# EAGLE design stm32cnc (EAGLE 9.6.2)
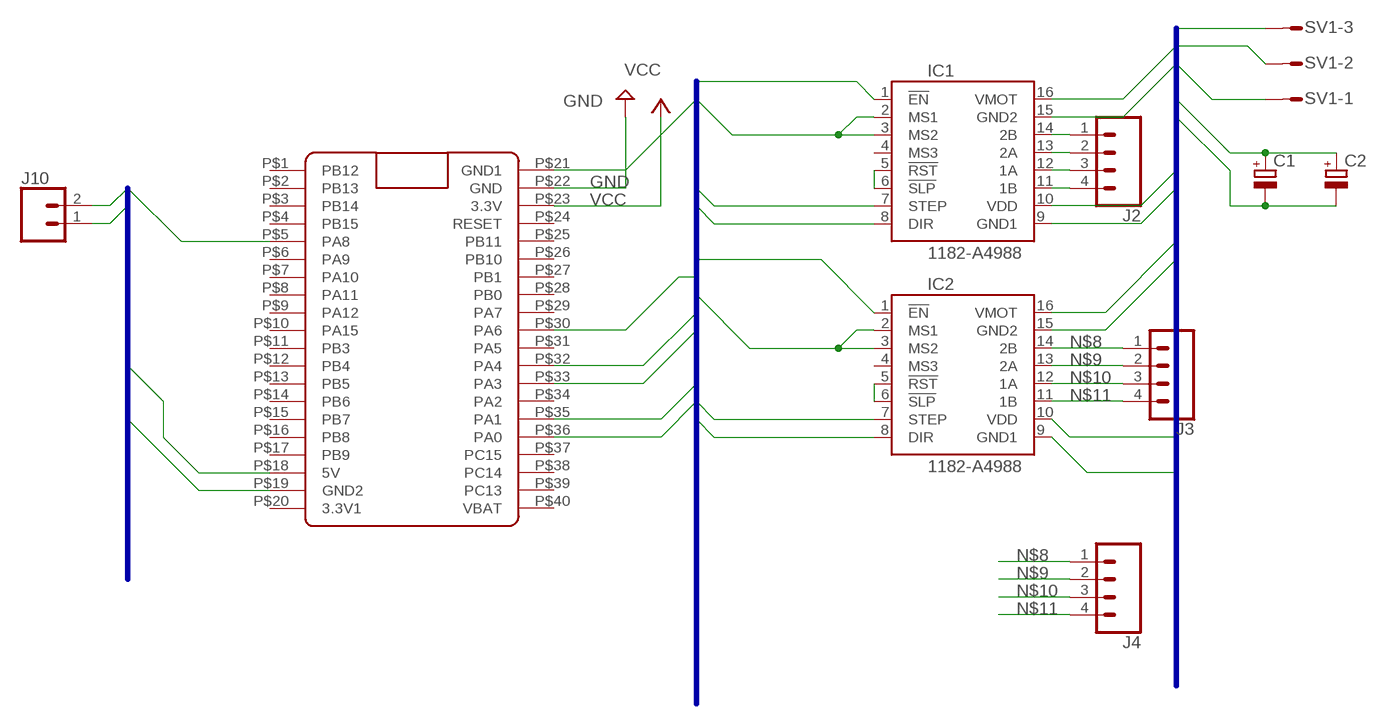
[diagram p0: schematic, sheet 1]

## Parts
C1  CPOL-EUE2,5-6E  [E2,5-6E]
C2  CPOL-EUE2,5-6E  [E2,5-6E]
IC1  1182-A4988  [A4988]
IC2  1182-A4988  [A4988]
J2  CONN_04POLAR  [MOLEX-1X4]
J3  CONN_04POLAR  [MOLEX-1X4]
J4  CONN_04POLAR  [MOLEX-1X4]
J10  CONN_02POLAR  [MOLEX-1X2]
SV1  MT6-3  [MT6-3]
U$1  BLUE_PILL  [BLUE_PILL]

## Nets
5-VCC: IC1.10(VDD) IC2.10(VDD) SV1.2 U$1.P$18(5V)
12-VCC: C1.+ C2.+ IC1.16(VMOT) IC2.16(VMOT) SV1.3
EN: IC1.1(!EN) IC2.1(!EN) U$1.P$30(PA6)
GND: C1.- C2.- IC1.9(GND1) IC1.15(GND2) IC2.9(GND1) IC2.15(GND2) J10.1 SV1.1 U$1.P$19(GND2) U$1.P$21(GND1) U$1.P$22(GND)
N$1: IC1.5(!RST) IC1.6(!SLP)
N$2: IC2.5(!RST) IC2.6(!SLP)
N$4: IC1.14(2B) J2.1
N$5: IC1.13(2A) J2.2
N$6: IC1.12(1A) J2.3
N$7: IC1.11(1B) J2.4
N$8: IC2.14(2B) J3.1 J4.1
N$9: IC2.13(2A) J3.2 J4.2
N$10: IC2.12(1A) J3.3 J4.3
N$11: IC2.11(1B) J3.4 J4.4
PWM: J10.2 U$1.P$5(PA8)
VCC: IC1.2(MS1) IC1.3(MS2) IC2.2(MS1) IC2.3(MS2) U$1.P$23(3.3V)
X-DIR: IC1.8(DIR) U$1.P$33(PA3)
X-STEP: IC1.7(STEP) U$1.P$36(PA0)
Y-DIR: IC2.8(DIR) U$1.P$32(PA4)
Y-STEP: IC2.7(STEP) U$1.P$35(PA1)
Unconnected: IC1.4(MS3) IC2.4(MS3) U$1.P$1(PB12) U$1.P$2(PB13) U$1.P$3(PB14) U$1.P$4(PB15) U$1.P$6(PA9) U$1.P$7(PA10) U$1.P$8(PA11) U$1.P$9(PA12) U$1.P$10(PA15) U$1.P$11(PB3) U$1.P$12(PB4) U$1.P$13(PB5) U$1.P$14(PB6) U$1.P$15(PB7) U$1.P$16(PB8) U$1.P$17(PB9) U$1.P$20(3.3V1) U$1.P$24(RESET) U$1.P$25(PB11) U$1.P$26(PB10) U$1.P$27(PB1) U$1.P$28(PB0) U$1.P$29(PA7) U$1.P$31(PA5) U$1.P$34(PA2) U$1.P$37(PC15) U$1.P$38(PC14) U$1.P$39(PC13) U$1.P$40(VBAT)

## Buses
5-VCC,12-VCC,E-GND,E-VCC,GND,VCC
EN,GND,RESET,VCC,X-DIR,X-LIMIT,X-STEP,Y-DIR,Y-LIMIT,Y-STEP
5-VCC,CTRL-RESET,DOOR,FLOOD,GND,HOLD,MIST,PROB,PWM,START,VCC

## Library data of the parts
C1 C2 = rcl:CPOL-EU: POLARIZED CAPACITOR, European symbol; SPICEPREFIX: C
IC1 IC2 = pololu-stepper-driver:1182-A4988: A4988 Stepper Motor Driver Carrier #1182 A4988 Stepper Motor Driver Carrier <https://www.pololu.com/product/1182> in Japan, Suzaku Lab. Ltd. <https://suzakugiken.jp/> #1182 A4988ステッピングモータドライバ <https://szc.jp/po1182>
J2-J4 = SparkFun-Connectors:CONN_04: Multi connection point. Often used as Generic Header-pin footprint for 0.1 inch spaced/style header connections On any of the 0.1 inch spaced packages, you can populate with these: Break Away Headers - Straight <https://www.sparkfun.com/products/116> (PRT-00116) Break Away Male Headers - Right Angle <https://www.sparkfun.com/products/553> (PRT-00553) Female Headers <https://www.sparkfun.com/products/115> (PRT-00115) Break Away Headers - Machine Pin <https://www.sparkfun.com/products/117> (PRT-00117) Break Away Female Headers - Swiss Machine Pin <https://www.sparkfun.com/products/743> (PRT-00743) For SCREWTERMINALS and SPRING TERMINALS visit here: Screw Terimnals on SparkFun.com <https://www.sparkfun.com/search/results?term=Screw+Terminals> (5mm/3.5mm/2.54mm spacing) This device is also useful as a general connection point to wire up your design to another part of your project. Our various solder wires solder well into these plated through hole pads. Hook-Up Wire - Assortment (Stranded, 22 AWG) <https://www.sparkfun.com/products/11375> (PRT-11375) Hook-Up Wire - Assortment (Solid Core, 22 AWG) <https://www.sparkfun.com/products/11367> (PRT-11367) View the entire wire category on our website here <https://www.sparkfun.com/categories/141> Special notes: Molex polarized connector foot print use with SKU : PRT-08231 with associated crimp pins and housings. 1MM SMD Version SKU: PRT-10208; PROD_ID: CONN-08186; SF_ID: PRT-08231
J10 = SparkFun-Connectors:CONN_02: Multi connection point. Often used as Generic Header-pin footprint for 0.1 inch spaced/style header connections On any of the 0.1 inch spaced packages, you can populate with these: Break Away Headers - Straight <https://www.sparkfun.com/products/116> (PRT-00116) Break Away Male Headers - Right Angle <https://www.sparkfun.com/products/553> (PRT-00553) Female Headers <https://www.sparkfun.com/products/115> (PRT-00115) Break Away Headers - Machine Pin <https://www.sparkfun.com/products/117> (PRT-00117) Break Away Female Headers - Swiss Machine Pin <https://www.sparkfun.com/products/743> (PRT-00743) For SCREWTERMINALS and SPRING TERMINALS visit here: Screw Terimnals on SparkFun.com <https://www.sparkfun.com/search/results?term=Screw+Terminals> (5mm/3.5mm/2.54mm spacing) This device is also useful as a general connection point to wire up your design to another part of your project. Our various solder wires solder well into these plated through hole pads. Hook-Up Wire - Assortment (Stranded, 22 AWG) <https://www.sparkfun.com/products/11375> (PRT-11375) Hook-Up Wire - Assortment (Solid Core, 22 AWG) <https://www.sparkfun.com/products/11367> (PRT-11367) View the entire wire category on our website here <https://www.sparkfun.com/categories/141> Special notes: Molex polarized connector foot print use with: PRT-08233 with associated crimp pins and housings. 2.54_SCREWTERM for use with PRT-10571. 3.5mm Screw Terminal footprints for PRT-08084 5mm Screw Terminal footprints for use with PRT-08432; SF_ID: PRT-09918
SV1 = con-amp-mt6:MT6-3: AMP MT6 CONNECTOR; OC_FARNELL: unknown; OC_NEWARK: unknown
U$1 = BluePill:BLUE_PILL

## Board
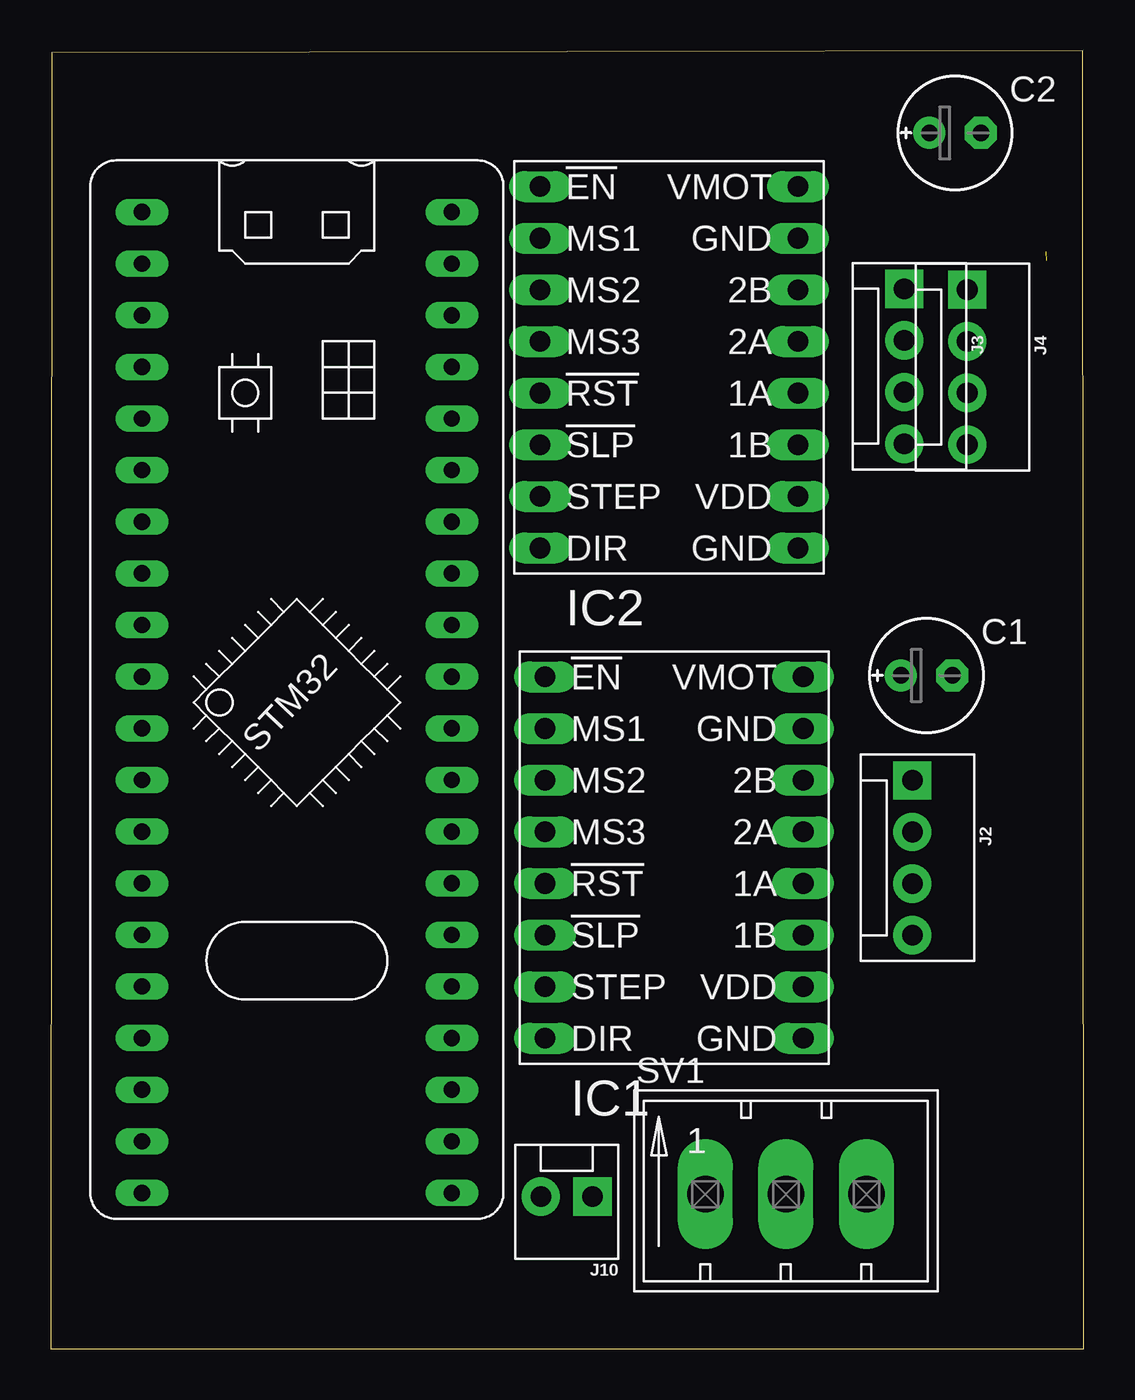
[diagram p1: board, top side]
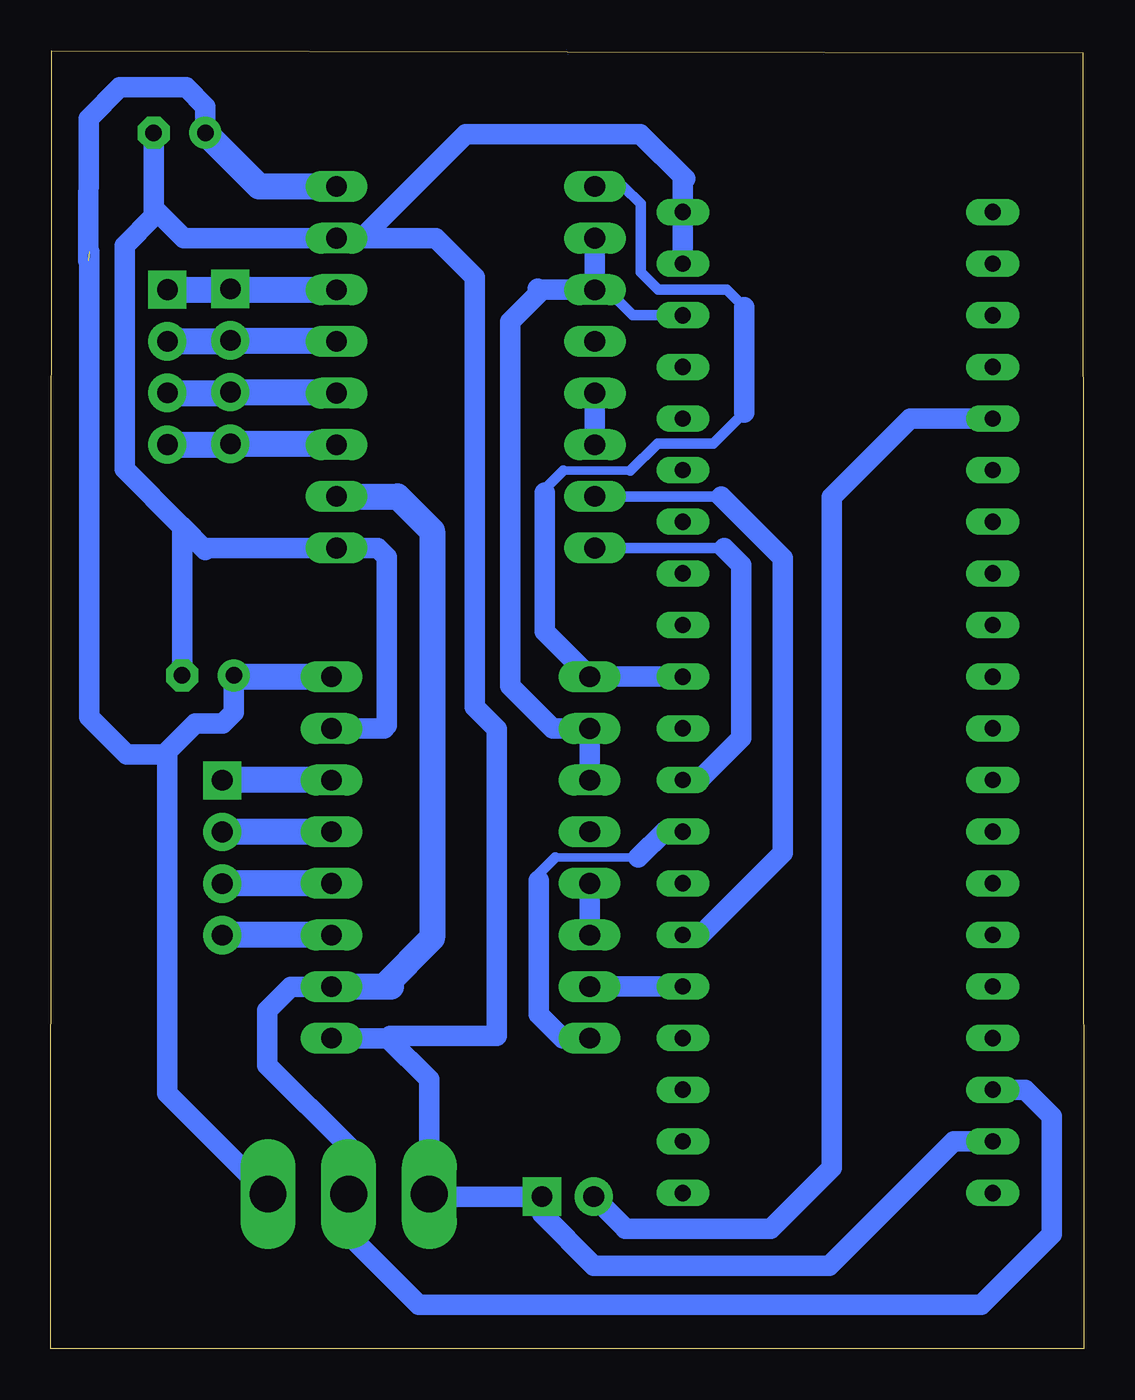
[diagram p2: board, bottom side, seen from below]

Size 50.8 x 63.85 mm. Coordinates in mm from the lower left corner, seen from the top.
Outline: 0,0 50.8,0 50.75,63.85 0.05,63.75 0,0
Copper layers (1*16): Top 0.035mm / dielectric 1.5mm / Bottom 0.035mm
Design rules "default *": minimum track width 6mil, minimum drill 0.35mm, track to track 20mil, track to pad 12mil, pad to pad 12mil, via to via 6mil, smd to smd 6mil, copper to edge 40mil, drill to drill 6mil, minimum pad ring 10mil, minimum via ring 8mil, stop-mask expansion 4mil, vias tented up to drill 0mil, thermal gap 10mil

### Footprints (pad centres in the part's own frame; a part is rotated, then mirrored left to right if it is on the bottom)
E2,5-6E = drill 0.813 pad 1.575: + -1.27,0 | drill 0.813 pad 1.575 octagon: - 1.27,0
A4988 = drill 1.016 long: 1 -6.35,8.89; 2 -6.35,6.35; 3 -6.35,3.81; 4 -6.35,1.27; 5 -6.35,-1.27; 6 -6.35,-3.81; 7 -6.35,-6.35; 8 -6.35,-8.89; 9 6.35,-8.89; 10 6.35,-6.35; 11 6.35,-3.81; 12 6.35,-1.27; 13 6.35,1.27; 14 6.35,3.81; 15 6.35,6.35; 16 6.35,8.89
MOLEX-1X4 = drill 1.016 pad 1.88 square: 1 0,0 | drill 1.016 pad 1.88: 2 2.54,0; 3 5.08,0; 4 7.62,0
MOLEX-1X2 = drill 1.016 pad 1.88 square: 1 0,0 | drill 1.016 pad 1.88: 2 2.54,0
MT6-3 = drill 1.803 long: 1 2.54,0; 2 6.502,0; 3 10.465,0
BLUE_PILL = drill 0.8 long: P$1 -7.62,15.24; P$2 -7.62,12.7; P$3 -7.62,10.16; P$4 -7.62,7.62; P$5 -7.62,5.08; P$6 -7.62,2.54; P$7 -7.62,0; P$8 -7.62,-2.54; P$9 -7.62,-5.08; P$10 -7.62,-7.62; P$11 -7.62,-10.16; P$12 -7.62,-12.7; P$13 -7.62,-15.24; P$14 -7.62,-17.78; P$15 -7.62,-20.32; P$16 -7.62,-22.86; P$17 -7.62,-25.4; P$18 -7.62,-27.94; P$19 -7.62,-30.48; P$20 -7.62,-33.02; P$21 7.62,15.24; P$22 7.62,12.7; P$23 7.62,10.16; P$24 7.62,7.62; P$25 7.62,5.08; P$26 7.62,2.54; P$27 7.62,0; P$28 7.62,-2.54; P$29 7.62,-5.08; P$30 7.62,-7.62; P$31 7.62,-10.16; P$32 7.62,-12.7; P$33 7.62,-15.24; P$34 7.62,-17.78; P$35 7.62,-20.32; P$36 7.62,-22.86; P$37 7.62,-25.4; P$38 7.62,-27.94; P$39 7.62,-30.48; P$40 7.62,-33.02

### Placement (x,y rotation side)
C1  43.07,33.12 0 top
C2  44.47,59.81 0 top
IC1  30.65,24.16 0 top
IC2  30.4,48.28 0 top
J2  42.37,27.96 270 top
J3  41.97,52.14 270 top
J4  45.07,52.1 270 top
J10  26.64,7.48 180 top
SV1  29.65,7.6 0 top
U$1  12.1,40.68 0 top

### Tracks (layer width: path | path; a pad name or v marks a point on that pad's centre or on a via)
5-VCC
  Bottom 1.016: U$1.P$18 2.88,12.74 1.58,11.44 1.58,5.62 5.05,2.15 32.7,2.15 36.2,5.65 36.2,7.55 SV1.2 36.15,9.95 40.15,13.95 40.15,16.65 38.99,17.81 IC1.10
  Bottom 1.27: 34.06,17.81 34.44,17.81 | IC2.10 33.75,41.93 32.05,40.23 32.05,20.2 34.44,17.81 | 34.44,17.81 IC1.10
12-VCC  (1 unrouted)
  Bottom 1.016: 45.07,29.22 45.07,12.55 SV1.3 | 48.95,53.53 48.93,60.51 47.4,62.05 44.15,62.05 43.2,61.1 C2.+ | 45.07,29.22 47.06,29.22 48.92,31.08 48.92,53.96 | C1.+ 41.8,31.29 42.34,30.75 43.7,30.75 45.07,29.37 45.07,29.22
  Bottom 1.27: IC2.16 40.56,57.17 C2.+ | IC1.16 41.73,33.05 C1.+
EN
  Bottom 0.406: 22.3,43.2 25.6,43.2
  Bottom 0.508: 19.17,33.06 U$1.P$30 | 25.6,43.2 26.5,42.3 26.5,42.12 | 22.3,43.2 20.96,44.53 18.22,44.53 16.7,46.05 | IC1.1 26.5,35.27 | IC2.1 22.65,57.17 21.8,56.32 21.8,52.97 20.93,52.1 17.55,52.1 16.7,51.25
  Bottom 1.016: U$1.P$30 IC1.1 24.3,33.07 26.5,35.27 26.5,42.12 | 16.7,51.25 16.7,46.05
GND
  Bottom 1.016: 34.22,15.27 IC1.9 | 34.22,15.27 32.19,13.24 SV1.1 32.07,7.48 J10.1 26.64,6.63 24.09,4.08 12.52,4.08 6.4,10.2 U$1.P$19 | U$1.P$22 U$1.P$21 19.72,57.43 19.6,57.55 21.8,59.75 30.4,59.75 35.52,54.63 IC2.15 | IC2.15 44.26,54.63 45.74,56.11 C2.- 45.74,55.71 47.17,54.28 47.17,43.27 44.4,40.5 44.34,40.44 | 44.34,40.44 43.2,39.3 43.11,39.39 IC2.9 34.71,39.39 34.27,38.95 34.27,30.65 34.41,30.51 IC1.15 | 34.22,15.27 34.11,15.38 28.86,15.38 28.86,30.48 29.95,31.56 29.95,52.72 31.86,54.63 IC2.15 | C1.- 44.34,40.44
  Bottom 1.27: IC2.9 36.86,39.5
N$1
  Bottom 1.016: IC1.6 IC1.5
N$2
  Bottom 0.508: 24.04,44.47 IC2.6
  Bottom 1.016: IC2.5 24.05,44.48 24.04,44.47
N$4
  Bottom 0.508: IC1.14 37.76,27.97 | J2.1
  Bottom 1.27: 37.76,27.97 J2.1
N$5
  Bottom 0.508: IC1.13 37.76,25.43 | J2.2
  Bottom 1.27: 37.76,25.43 J2.2
N$6
  Bottom 0.508: IC1.12 37.76,22.89 | J2.3
  Bottom 1.27: 37.76,22.89 J2.3
N$7
  Bottom 0.508: IC1.11 37.76,20.35 | J2.4
  Bottom 1.27: 37.76,20.35 J2.4
N$8
  Bottom 1.27: IC2.14 37.51,52.09 41.92,52.09 J3.1 42.01,52.1 J4.1
N$9
  Bottom 1.27: IC2.13 37.51,49.55 37.56,49.6 J3.2 42.01,49.56 J4.2
N$10
  Bottom 0.508: 37.56,47.06 37.51,47.01
  Bottom 1.27: IC2.12 37.56,47.06 J3.3 42.01,47.02 J4.3
N$11
  Bottom 0.508: 37.56,44.52 37.51,44.47
  Bottom 1.27: IC2.11 37.56,44.52 J3.4 42.01,44.48 J4.4
PWM
  Bottom 0.508: J10.2 24.1,7.45 22.55,5.9
  Bottom 1.016: U$1.P$5 8.54,45.76 12.4,41.9 12.4,8.9 15.4,5.9 22.55,5.9 22.55,5.93 J10.2
VCC
  Bottom 0.508: 20.02,50.84 U$1.P$23 22.19,50.84 23.44,52.09 IC2.3 24.11,52.15 26.85,52.15 | 28.2,50.31 28.2,50.52
  Bottom 1.016: IC1.3 IC1.2 26.11,30.51 28.2,32.6 28.2,50.31 | IC2.2 IC2.3 26.79,52.09 26.85,52.15 26.85,51.87 28.2,50.52
X-DIR
  Bottom 0.406: 21.9,24.16 25.99,24.16
  Bottom 0.508: 25.99,24.16 26.8,23.35 26.8,23.03
  Bottom 1.016: IC1.8 25.62,15.27 26.8,16.45 26.8,23.03 | U$1.P$33 20.62,25.44 21.9,24.16
X-STEP
  Bottom 1.016: U$1.P$36 IC1.7
Y-DIR
  Bottom 0.508: 19.26,27.98 18.92,27.98 | 16.85,38.55 17.69,39.39 IC2.8
  Bottom 1.016: 17.69,39.39 16.87,38.57 16.87,38.55 | 16.85,38.55 16.85,30.05 18.92,27.98 | U$1.P$32 19.26,27.98
Y-STEP
  Bottom 0.508: IC2.7 17.83,41.93
  Bottom 1.016: U$1.P$35 18.84,20.36 14.81,24.39 14.81,38.91 17.83,41.93